# Altium schematic sheet Main.SchDoc
size 381 x 241 mm; SheetNumber: 1; SheetTotal: 1
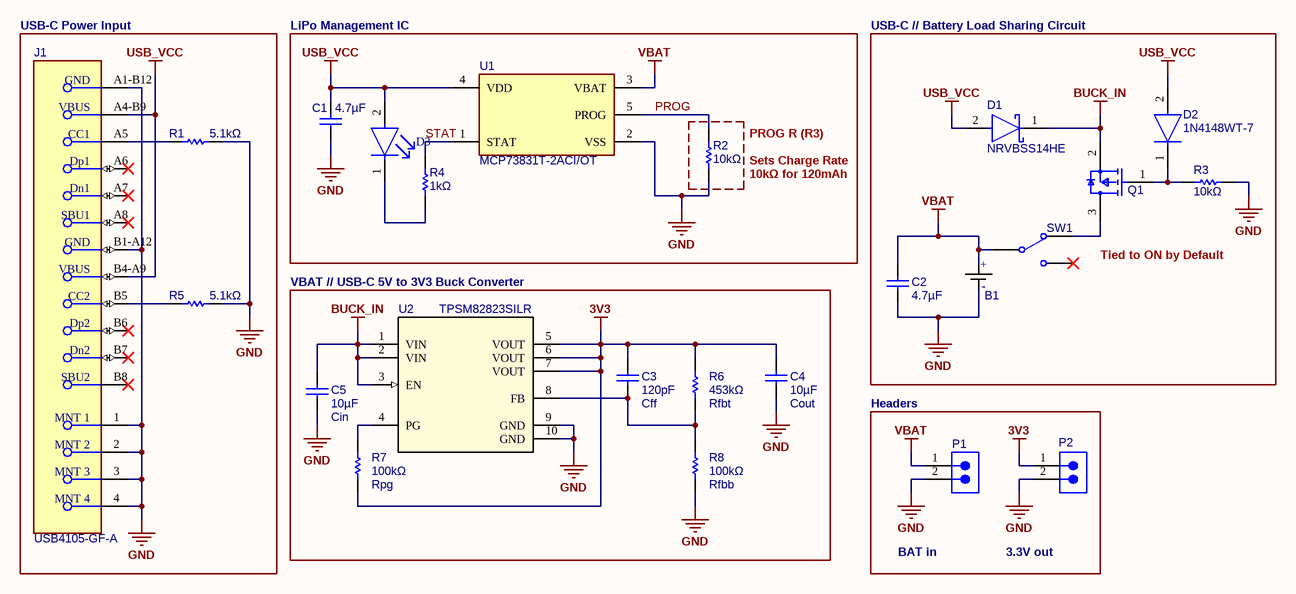
[diagram p0: Main.SchDoc]

## Parts
B1  LiPo  (value not drawn)
C1  4.7µF  [WCAP-CSGP_0603_L1.6W0.8H0.8_Reflow]
C2  4.7µF  [WCAP-CSGP_0603_L1.6W0.8H0.8_Reflow]
C3  120pF  [WCAP-CSGP_0603_L1.6W0.8H0.8_Reflow]
C4  10µF  [WCAP-CSGP_0603_L1.6W0.8H0.8_Reflow]
C5  10µF  [WCAP-CSGP_0603_L1.6W0.8H0.8_Reflow]
D1  NRVBSS14HE  [FP-477AD-MFG]
D2  1N4148WT-7  [FP-SOD523-MFG]
D3  LTST-C190KGKT  [FP-LTST-C190KGKT-MFG]  (value not drawn)
J1  USB4105-GF-A  [FP-USB4105-GF-A-MFG]
P1  61300211121  [61300211121]  (value not drawn)
P2  61300211121  [61300211121]  (value not drawn)
Q1  IRLML6402TRPBF  [FP-Micro3-MFG]  (value not drawn)
R1  5.1kΩ  [RESC1608X55X25NL10T15]
R2  10kΩ  [RESC1608X55X25NL10T15]
R3  10kΩ  [RESC1608X55X25NL10T15]
R4  1kΩ  [RESC1608X55X25NL10T15]
R5  5.1kΩ  [RESC1608X55X25NL10T15]
R6  453kΩ  [RESC1608X55X25NL10T15]
R7  100kΩ  [RESC1608X55X25NL10T15]
R8  100kΩ  [RESC1608X55X25NL10T15]
SW1  450404015514  [450404015514]  (value not drawn)
U1  MCP73831T-2ACI/OT  [FP-C04-091-OT-IPC_B]
U2  TPSM82823SILR  [SIL0010D-MFG]

## Blocks framed on the sheet
USB-C Power Input: J1 R1 R5

## Nets
3V3: C3.2 C4.2 P2.1 R6.1 R7.2 U2.5(VOUT) U2.6(VOUT) U2.7(VOUT)
BUCK_IN: C5.2 D1.1(C) Q1.2(S) U2.1(VIN) U2.2(VIN) U2.3(EN)
GND: B1.1(-) C1.1 C2.1 C4.1 C5.1 J1.1(MNT_1) J1.2(MNT_2) J1.3(MNT_3) J1.4(MNT_4) J1.A1-B12(GND) J1.B1-A12(GND) P1.2 P2.2 R1.1 R2.2 R3.2 R5.1 R8.2 U1.2(VSS) U2.9(GND) U2.10(GND)
USB_VCC: C1.2 D1.2(A) D2.2(A) D3.2(A) J1.A4-B9(VBUS) J1.B4-A9(VBUS) U1.4(VDD)
VBAT: B1.0(+) C2.2 P1.1 SW1.COM U1.3(VBAT)
PROG: R2.1 U1.5(PROG)
STAT: R4.2 U1.1(STAT)
NetC3_1: C3.1 R6.2 R8.1 U2.8(FB)
NetD2_1: D2.1(C) Q1.1(G) R3.1
NetD3_1: D3.1(C) R4.1
NetJ1_A5: J1.A5(CC1) R1.2
NetJ1_B5: J1.B5(CC2) R5.2
NetQ1_3: Q1.3(D) SW1.L1
NetR7_1: R7.1 U2.4(PG)

Not connected (* = marked no-connect by the designer): J1 A6(Dp1)* A7(Dn1)* A8(SBU1)* B6(Dp2)* B7(Dn2)* B8(SBU2)*; SW1 L2*

## Notes on the sheet
- LiPo Management IC
- USB-C // Battery Load Sharing Circuit
- (near R2) PROG R (R3)
- (near R2) Sets Charge Rate
- (near R2) 10kΩ for 120mAh
- VBAT // USB-C 5V to 3V3 Buck Converter
- Tied to ON by Default
- Cin
- (near C3) Cff
- (near R6) Rfbt
- (near C4) Cout
- Headers
- (near R7) Rpg
- (near R8) Rfbb
- BAT in
- 3.3V out

## Library data of the parts
B1 = 3.7V 30mAh LiPo
C1-C3 C5 = CMP-207839-000060-3
C4 = CMP-207839-000060-3: 10V tolerance
D1 = CMP-00278-93203856-2: NRVBSS14HE Rectifier Diode, Schottky, 1 Phase, 1 Element, 1A, 40V V(RRM), Silicon; Manufacturer Lifecycle Status: ACTIVE; Capacitance: 55pF; Max Forward Surge Current (Ifsm): 25A; Peak Reverse Current: 5µA; Max Junction Temperature (Tj): 150°C; Forward Current: 1A; Min Operating Temperature: -55°C; NexarPartId: 93203856; Reverse Voltage: 40V; Max Operating Temperature: 150°C; RoHS: Compliant; Lifecycle Status: Production; Max Repetitive Reverse Voltage (Vrrm): 40V; Height: 750µm
D2 = CMP-2000-05518-3: DIODE GEN PURP 80V 125MA SOD523; Power Rating: 150mW; Peak Non-Repetitive Surge Current: 2A; Forward Voltage: 1.25V; Reverse Recovery Time: 4ns; Peak Reverse Current: 1uA; Max Repetitive Reverse Voltage (Vrrm): 100V; Capacitance: 2pF; Polarity: Standard; Element Configuration: Single; Forward Current: 250mA; Lead Free: Lead Free; Packaging: Tape and Reel; Length: 0.9mm; Min Operating Temperature: -65°C; Current Rating: 125mA; Max Reverse Voltage (DC): 80V; Width: 1.3mm; Package Quantity: 3000; Output Current: 125mA; Power Dissipation: 150mW; Max Operating Temperature: 150°C; Radiation Hardening: No; Average Rectified Current: 125mA; Height: 0.65mm; Voltage Rating (DC): 80V; Max Surge Current: 2A; Weight: 3.5E-05oz; Recovery Time: 4ns; Max Forward Surge Current (Ifsm): 2A; Contact Plating: Tin; Number of Pins: 2; Mount: Surface Mount; REACH SVHC: No SVHC
D3 = CMP-2000-05197-2: LED GREEN CLEAR CHIP SMD; Test Current: 20mA; Power Rating: 75mW; Forward Voltage: 2V; Wavelength: 574nm; Number of LEDs: 1; Reverse Voltage: 5V; Dominant Wavelength: 571nm; Lens Style: Diffused; Luminous Intensity: 35mcd; Forward Current: 30mA; Viewing Angle: 130°; Lens Color: Colorless; Width: 0.8mm; Case Code (Imperial): 0603; Case Code (Metric): 1608; Number of Pins: 2; Radiation Hardening: No; Package Quantity: 1; Lead Free: Lead Free; Lens Transparency: Clear; Depth: 0.8mm; Power Dissipation: 75mW; Mount: Surface Mount; Max Operating Temperature: 85°C; Case/Package: 0603; Height: 0.8mm; Illumination Color: Green; Color: Green; Length: 1.6mm; Packaging: Tape and Reel; Number of Elements: 1; Min Operating Temperature: -55°C
J1 = CMP-245163-000001-1: CONN RCPT USB2.0 TYPEC 5A; Manufacturer: GCT; Voltage Rating: 20V; Is Female: yes; Current Rating: 5/6.25/1.25/0.25A; Number Of Contacts: 16; Conn Orientation: Right Angle; Device Class L1: Connectors; Category: Conn; Lead Free: Yes; RoHS: TRUE; Temperature Range High: +85°C; Digikey Description: CONN RCPT USB2.0 TYPEC 5A; Device Class L3: unset; ComponentLink2Description: Datasheet; Manufacturer Part Number: USB4105-GF-A; Package: 0; Usb Standard: USB 2.0; Device Class L2: USB Connectors; Automotive: No; Temperature Range Low: -40°C; Height: 3.46mm; Temperature: -40°C to +85°C; Contact Material: Gold,Nickel; ComponentLink2URL: https://gct.co/files/drawings/usb4105.pdf; Octopart: https://octopart.com/usb4105-gf-a-gct-106627878
P1 P2 = CMP-1712-00002-6: NexarPartId: 20081794; Number of Contacts: 2; Pitch: 2.54mm; Connector Type: Male Pin; Voltage Rating: 250V; Current Rating: 3A; Gender: Male; Contact Resistance: 20mΩ; Height: 8.94mm; Lead Free: Lead Free; Number of Pins: 2; Termination: Through Hole; RoHS: Compliant; Lead Pitch: 2.54mm; REACH SVHC: No SVHC; Housing Material: PBT; Contact Mating Length: 5.9944mm; Min Operating Temperature: -40°C; Orientation: Vertical; Contact Material: Copper; Contact Gender: Male; Max Operating Temperature: 125°C; Number of Rows: 1; Number of Positions: 2; Packaging: Bulk; Contact Plating: Gold; Mount: Through Hole; Color: Black; Operating Supply Voltage: 250V
Q1 = CMP-32901-000130-1: MOSFET P-CH 20V 3.7A SOT-23; Manufacturer: Infineon; Reverse Recovery Time: 29ns; Max Forward Diode Voltage: -1.2V; Input Capacitace At Vds: 633pF @ -10V; Drain To Source Resistance: 0.05Ω; Gate To Source Voltage: 12V; Max Junction Temp: +150°C; Pulse Drain Current: -22A; Threshold Vgs Min: -0.4V; Turn Off Delay Time: 588ns; Number Of Channels: 1; Power Dissipation: 1.3W; Turn On Delay Time: 350ns; Drain To Source Breakdown Voltage: -20V; Continuous Drain Current: -3.7A; Depletion Mode: False; Gate Charge At Vgs: 8nC @ -5V; Rthja Max: 75°C/W; Threshold Vgs: -0.55V; Standoff Height: 0.01mm; Reverse Recovery Charge: 11nC; Device Class L2: Transistors; Ipc Land Pattern Name: SOT95P237X100-3; Temperature Range High: +150°C; Octopart: https://octopart.com/irlml6402trpbf-infineon-65874989; ComponentLink2URL: https://www.infineon.com/dgdl/irlml6402pbf.pdf?fileId=5546d462533600a401535668d5c2263c; Automotive: No; Manufacturer Part Number: IRLML6402TRPBF; Height: 1.12mm; Drain To Source Voltage: -20V; Digikey Description: MOSFET P-CH 20V 3.7A SOT-23; Device Class L1: Discrete Semiconductors; Package: Micro3; Lead Free: Yes; Temperature Range Low: -55°C; Number Of P Channels: 1; Technology: MOSFET; Temperature: -55°C to +150°C; Category: Trans; Footprint Url: http://irf.com/package/outline/po_micro3.pdf; RoHS: TRUE; Device Class L3: MOSFETs; Threshold Vgs Max: -1.2V; ComponentLink2Description: Datasheet
R1-R8 = CMP-2000-04186-1
SW1 = CMP-03913-99472344-1: 450404015514 Slide Switch, 0.3A, 5Vdc, Smd Rohs Compliant: Yes; Current Rating: 300mA; Insulation Resistance: 100MΩ; Voltage Rating: 5V; NexarPartId: 99472344; Min Operating Temperature: -40°C; Contact Plating: Silver; Packaging: Tape and Reel; Max Operating Temperature: 85°C; RoHS: Compliant
U1 = CMP-0133-00143-2: IC CONTROLLR LI-ION 4.2V SOT23-5; Max Power Dissipation: 1.54W; Output Current: 500mA; Max Output Voltage: 4.5V; Number of Outputs: 1; Min Output Voltage: 4.168V; Min Supply Voltage: 3.75V; Max Input Voltage: 6V; Voltage Rating: 4.534V; Drain to Source Resistance: 350mR; Max Operating Temperature: 85°C; Length: 0.122inch; Number of Pins: 5; REACH SVHC: No SVHC; Radiation Hardening: No; Min Operating Temperature: -40°C; Weight: 0.00709oz; Contact Plating: Tin; Termination: SMD/SMT; Case/Package: SOT-23; Mount: Surface Mount; Width: 0.071inch; Packaging: Tape and Reel; Number of Cells: 1; Max Charge Current: 500mA; Height: 0.051inch; Number of Channels: 1; Output Voltage: 4.2V; Max Supply Voltage: 6V; Lead Free: Lead Free
U2 = TPSM82823SILR: No Description Available; Mfr_Name: Texas Instruments; TYPE: TYPE; RefDes: RefDes